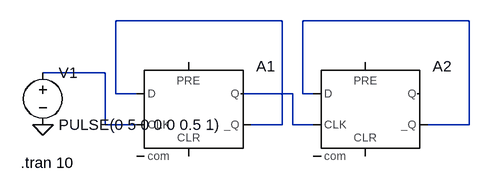
[diagram p0: schematic FlipFlopD-Simasc.asc]
FlipFlopD-Simasc.asc, the LTspice schematic file:
Version 4
SHEET 1 880 680
WIRE 272 32 16 32
WIRE 560 32 304 32
WIRE 0 112 -96 112
WIRE 16 144 16 32
WIRE 48 144 16 144
WIRE 288 144 208 144
WIRE 304 144 304 32
WIRE 320 144 304 144
WIRE 0 192 0 112
WIRE 48 192 0 192
WIRE 272 192 272 32
WIRE 272 192 224 192
WIRE 288 192 288 144
WIRE 320 192 288 192
WIRE 560 192 560 32
WIRE 560 192 496 192
FLAG -96 192 0
SYMBOL Digital\\dflop 128 96 R0
SYMATTR InstName A1
SYMBOL voltage -96 96 R0
WINDOW 123 0 0 Left 2
WINDOW 39 0 0 Left 2
SYMATTR InstName V1
SYMATTR Value PULSE(0 5 0 0 0 0.5 1)
SYMBOL Digital\\dflop 400 96 R0
SYMATTR InstName A2
TEXT -130 250 Left 2 !.tran 10

The netlist it stands for:
* FlipFlopD-Simasc.asc
A1 N001 0 N003 0 0 N001 N004 0 DFLOP
V1 N003 0 PULSE(0 5 0 0 0 0.5 1)
A2 N002 0 N004 0 0 N002 0 0 DFLOP
.tran 10
.backanno
.end